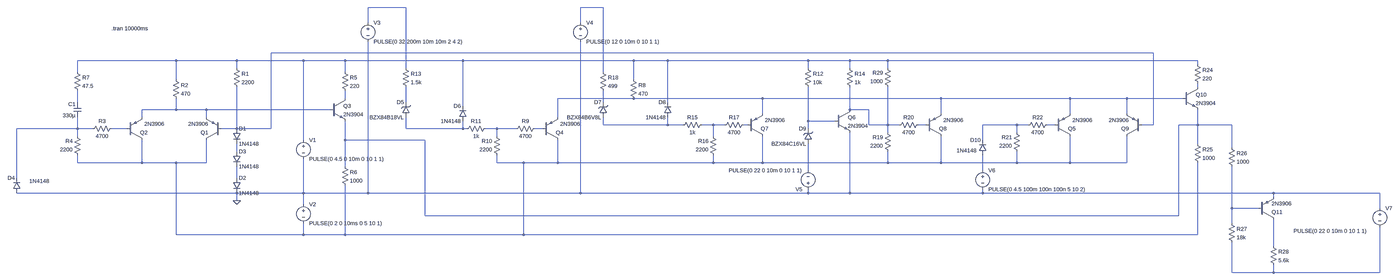
[diagram p0: schematic Powerup_and_voltage_monitor.asc, whole sheet]
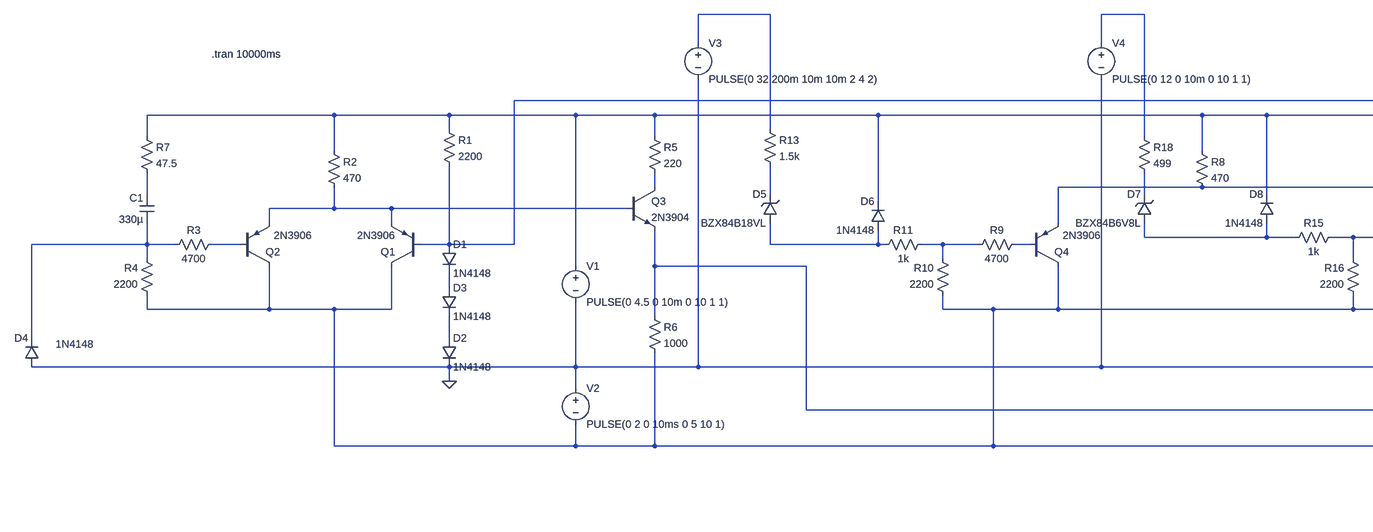
[diagram p1: schematic Powerup_and_voltage_monitor.asc, part, row 1 of 1, column 1 of 2]
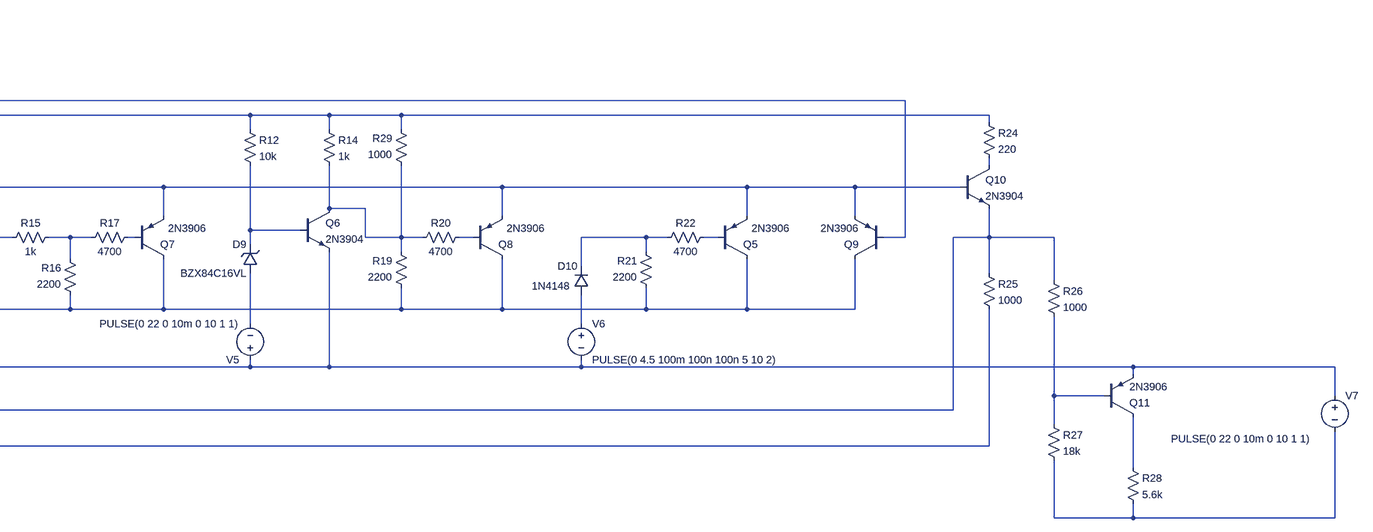
[diagram p2: schematic Powerup_and_voltage_monitor.asc, part, row 1 of 1, column 2 of 2]
Powerup_and_voltage_monitor.asc, the LTspice schematic file:
Version 4
SHEET 1 5904 952
WIRE 1392 -176 1232 -176
WIRE 2224 -176 2128 -176
WIRE 1232 -112 1232 -176
WIRE 2128 -112 2128 -176
WIRE 4544 16 768 16
WIRE 368 48 -48 48
WIRE 624 48 368 48
WIRE 960 48 624 48
WIRE 1136 48 960 48
WIRE 1632 48 1136 48
WIRE 2352 48 1632 48
WIRE 2496 48 2352 48
WIRE 3088 48 2496 48
WIRE 3264 48 3088 48
WIRE 3424 48 3264 48
WIRE 4784 48 3424 48
WIRE 4784 64 4784 48
WIRE 624 80 624 48
WIRE 1392 80 1392 -176
WIRE 3088 80 3088 48
WIRE 3264 80 3264 48
WIRE 3424 80 3424 48
WIRE -48 96 -48 48
WIRE 1136 96 1136 48
WIRE 2224 96 2224 -176
WIRE 368 128 368 48
WIRE 2352 128 2352 48
WIRE 4784 160 4784 144
WIRE 1136 208 1136 176
WIRE 2352 208 2032 208
WIRE 2896 208 2352 208
WIRE 3648 208 2896 208
WIRE 4192 208 3648 208
WIRE 4432 208 4192 208
WIRE 4720 208 4432 208
WIRE -48 224 -48 176
WIRE 1392 224 1392 160
WIRE 2224 224 2224 176
WIRE 2496 224 2496 48
WIRE 1632 240 1632 48
WIRE 368 256 368 208
WIRE 368 256 224 256
WIRE 496 256 368 256
WIRE 1072 256 496 256
WIRE 3264 256 3264 160
WIRE 3344 256 3264 256
WIRE 2896 272 2896 208
WIRE 3648 272 3648 208
WIRE 4192 272 4192 208
WIRE 4432 272 4432 208
WIRE 224 288 224 256
WIRE 496 288 496 256
WIRE 2032 288 2032 208
WIRE 3088 304 3088 160
WIRE 3200 304 3088 304
WIRE 2224 320 2224 288
WIRE 2496 320 2496 288
WIRE 2496 320 2224 320
WIRE 2560 320 2496 320
WIRE 2688 320 2640 320
WIRE 2736 320 2688 320
WIRE 2832 320 2816 320
WIRE 3344 320 3344 256
WIRE 3424 320 3424 160
WIRE 3424 320 3344 320
WIRE 3472 320 3424 320
WIRE 3584 320 3552 320
WIRE 3968 320 3824 320
WIRE 4016 320 3968 320
WIRE 4128 320 4096 320
WIRE 4544 320 4544 16
WIRE 4544 320 4496 320
WIRE 4784 320 4784 256
WIRE 4784 320 4704 320
WIRE 4928 320 4784 320
WIRE -48 336 -48 288
WIRE -48 336 -304 336
WIRE 16 336 -48 336
WIRE 160 336 96 336
WIRE 624 336 624 160
WIRE 624 336 560 336
WIRE 768 336 768 16
WIRE 768 336 624 336
WIRE 1392 336 1392 288
WIRE 1632 336 1632 304
WIRE 1632 336 1392 336
WIRE 1648 336 1632 336
WIRE 1776 336 1728 336
WIRE 1856 336 1776 336
WIRE 1968 336 1936 336
WIRE 3088 336 3088 304
WIRE 3424 352 3424 320
WIRE 3968 352 3968 320
WIRE -48 368 -48 336
WIRE 1776 368 1776 336
WIRE 2688 368 2688 320
WIRE 960 384 960 48
WIRE 1136 384 1136 304
WIRE 1472 384 1136 384
WIRE 3824 384 3824 320
WIRE 4784 400 4784 320
WIRE 4928 416 4928 320
WIRE 624 432 624 400
WIRE -48 480 -48 448
WIRE 224 480 224 384
WIRE 224 480 -48 480
WIRE 368 480 224 480
WIRE 496 480 496 384
WIRE 496 480 368 480
WIRE 1776 480 1776 448
WIRE 1888 480 1776 480
WIRE 2032 480 2032 384
WIRE 2032 480 1888 480
WIRE 2688 480 2688 448
WIRE 2688 480 2032 480
WIRE 2896 480 2896 368
WIRE 2896 480 2688 480
WIRE 3424 480 3424 432
WIRE 3424 480 2896 480
WIRE 3648 480 3648 368
WIRE 3648 480 3424 480
WIRE 3968 480 3968 432
WIRE 3968 480 3648 480
WIRE 4192 480 4192 368
WIRE 4192 480 3968 480
WIRE 4432 480 4432 368
WIRE 4432 480 4192 480
WIRE 1136 496 1136 384
WIRE 3088 512 3088 400
WIRE 3824 512 3824 448
WIRE -304 544 -304 336
WIRE 624 544 624 496
WIRE 624 608 -304 608
WIRE 960 608 960 464
WIRE 960 608 624 608
WIRE 1232 608 1232 -32
WIRE 1232 608 960 608
WIRE 2128 608 2128 -32
WIRE 2128 608 1232 608
WIRE 3088 608 3088 592
WIRE 3088 608 2128 608
WIRE 3264 608 3264 352
WIRE 3264 608 3088 608
WIRE 3824 608 3824 592
WIRE 3824 608 3264 608
WIRE 5104 608 3824 608
WIRE 5552 608 5104 608
WIRE 5104 624 5104 608
WIRE 624 640 624 608
WIRE 960 656 960 608
WIRE 4928 672 4928 496
WIRE 5040 672 4928 672
WIRE 5552 672 5552 608
WIRE 1472 704 1472 384
WIRE 4704 704 4704 320
WIRE 4704 704 1472 704
WIRE 4928 736 4928 672
WIRE 368 784 368 480
WIRE 960 784 960 736
WIRE 960 784 368 784
WIRE 1136 784 1136 576
WIRE 1136 784 960 784
WIRE 1888 784 1888 480
WIRE 1888 784 1136 784
WIRE 4784 784 4784 480
WIRE 4784 784 1888 784
WIRE 5104 832 5104 720
WIRE 4928 944 4928 816
WIRE 5104 944 5104 912
WIRE 5104 944 4928 944
WIRE 5552 944 5552 752
WIRE 5552 944 5104 944
FLAG 624 640 0
SYMBOL pnp 560 384 R180
SYMATTR InstName Q1
SYMATTR Value 2N3906
SYMBOL pnp 160 384 M180
WINDOW 3 74 68 Left 2
SYMATTR Value 2N3906
SYMATTR InstName Q2
SYMBOL Res 608 64 R0
SYMATTR InstName R1
SYMATTR Value 2200
SYMBOL diode 608 336 R0
SYMATTR InstName D1
SYMATTR Value 1N4148
SYMBOL diode 608 544 R0
SYMATTR InstName D2
SYMATTR Value 1N4148
SYMBOL voltage 960 368 R0
WINDOW 123 0 0 Left 0
WINDOW 39 0 0 Left 0
SYMATTR InstName V1
SYMATTR Value PULSE(0 4.5 0 10m 0 10 1 1)
SYMBOL Res 352 112 R0
SYMATTR InstName R2
SYMATTR Value 470
SYMBOL Res 112 320 R90
WINDOW 0 0 56 VBottom 2
WINDOW 3 32 56 VTop 2
SYMATTR InstName R3
SYMATTR Value 4700
SYMBOL Res -32 464 R180
WINDOW 0 36 76 Left 2
WINDOW 3 36 40 Left 2
SYMATTR InstName R4
SYMATTR Value 2200
SYMBOL voltage 960 640 R0
WINDOW 123 0 0 Left 0
WINDOW 39 0 0 Left 0
SYMATTR InstName V2
SYMATTR Value PULSE(0 2 0 10ms 0 5 10 1)
SYMBOL npn 1072 208 R0
SYMATTR InstName Q3
SYMATTR Value 2N3904
SYMBOL Res 1120 80 R0
SYMATTR InstName R5
SYMATTR Value 220
SYMBOL Res 1120 480 R0
SYMATTR InstName R6
SYMATTR Value 1000
SYMBOL diode 608 432 R0
SYMATTR InstName D3
SYMATTR Value 1N4148
SYMBOL cap -32 288 R180
WINDOW 0 24 56 Left 2
WINDOW 3 24 8 Left 2
SYMATTR InstName C1
SYMATTR Value 330µ
SYMBOL res -64 80 R0
SYMATTR InstName R7
SYMATTR Value 47.5
SYMBOL diode -288 608 R180
WINDOW 0 24 64 Left 2
WINDOW 3 -122 51 Left 2
SYMATTR InstName D4
SYMATTR Value 1N4148
SYMBOL pnp 1968 384 M180
WINDOW 3 74 68 Left 2
SYMATTR Value 2N3906
SYMATTR InstName Q4
SYMBOL Res 2336 112 R0
SYMATTR InstName R8
SYMATTR Value 470
SYMBOL Res 1952 320 R90
WINDOW 0 0 56 VBottom 2
WINDOW 3 32 56 VTop 2
SYMATTR InstName R9
SYMATTR Value 4700
SYMBOL Res 1792 464 R180
WINDOW 0 36 76 Left 2
WINDOW 3 36 40 Left 2
SYMATTR InstName R10
SYMATTR Value 2200
SYMBOL zener 1408 288 R180
WINDOW 0 24 64 Left 2
WINDOW 3 24 0 Left 2
SYMATTR InstName D5
SYMATTR Value BZX84B18VL
SYMBOL diode 1648 304 R180
WINDOW 0 24 64 Left 2
WINDOW 3 24 0 Left 2
SYMATTR InstName D6
SYMATTR Value 1N4148
SYMBOL Res 1744 320 R90
WINDOW 0 0 56 VBottom 2
WINDOW 3 32 56 VTop 2
SYMATTR InstName R11
SYMATTR Value 1k
SYMBOL Res 1376 64 R0
SYMATTR InstName R13
SYMATTR Value 1.5k
SYMBOL voltage 1232 -128 R0
WINDOW 123 0 0 Left 0
WINDOW 39 0 0 Left 0
SYMATTR InstName V3
SYMATTR Value PULSE(0 32 200m 10m 10m 2 4 2)
SYMBOL zener 2240 288 R180
WINDOW 0 24 64 Left 2
WINDOW 3 24 0 Left 2
SYMATTR InstName D7
SYMATTR Value BZX84B6V8L
SYMBOL diode 2512 288 R180
WINDOW 0 24 64 Left 2
WINDOW 3 24 0 Left 2
SYMATTR InstName D8
SYMATTR Value 1N4148
SYMBOL Res 2656 304 R90
WINDOW 0 0 56 VBottom 2
WINDOW 3 32 56 VTop 2
SYMATTR InstName R15
SYMATTR Value 1k
SYMBOL Res 2704 464 R180
WINDOW 0 36 76 Left 2
WINDOW 3 36 40 Left 2
SYMATTR InstName R16
SYMATTR Value 2200
SYMBOL Res 2832 304 R90
WINDOW 0 0 56 VBottom 2
WINDOW 3 32 56 VTop 2
SYMATTR InstName R17
SYMATTR Value 4700
SYMBOL voltage 2128 -128 R0
WINDOW 123 0 0 Left 0
WINDOW 39 0 0 Left 0
SYMATTR InstName V4
SYMATTR Value PULSE(0 12 0 10m 0 10 1 1)
SYMBOL Res 2208 80 R0
SYMATTR InstName R18
SYMATTR Value 499
SYMBOL npn 3200 256 R0
SYMATTR InstName Q6
SYMATTR Value 2N3904
SYMBOL voltage 3088 608 R180
WINDOW 123 0 0 Left 0
WINDOW 39 0 0 Left 0
SYMATTR InstName V5
SYMATTR Value PULSE(0 22 0 10m 0 10 1 1)
SYMBOL zener 3104 400 R180
WINDOW 0 24 64 Left 2
WINDOW 3 24 0 Left 2
SYMATTR InstName D9
SYMATTR Value BZX84C16VL
SYMBOL Res 3072 64 R0
SYMATTR InstName R12
SYMATTR Value 10k
SYMBOL Res 3248 64 R0
SYMATTR InstName R14
SYMATTR Value 1k
SYMBOL Res 3440 448 R180
WINDOW 0 36 76 Left 2
WINDOW 3 36 40 Left 2
SYMATTR InstName R19
SYMATTR Value 2200
SYMBOL Res 3568 304 R90
WINDOW 0 0 56 VBottom 2
WINDOW 3 32 56 VTop 2
SYMATTR InstName R20
SYMATTR Value 4700
SYMBOL pnp 2832 368 M180
WINDOW 3 74 68 Left 2
SYMATTR Value 2N3906
SYMATTR InstName Q7
SYMBOL pnp 3584 368 M180
WINDOW 3 74 68 Left 2
SYMATTR Value 2N3906
SYMATTR InstName Q8
SYMBOL voltage 3824 496 R0
WINDOW 123 0 0 Left 0
WINDOW 39 0 0 Left 0
SYMATTR InstName V6
SYMATTR Value PULSE(0 4.5 100m 100n 100n 5 10 2)
SYMBOL diode 3840 448 R180
WINDOW 0 24 64 Left 2
WINDOW 3 41 20 Left 2
SYMATTR InstName D10
SYMATTR Value 1N4148
SYMBOL Res 3984 448 R180
WINDOW 0 36 76 Left 2
WINDOW 3 36 40 Left 2
SYMATTR InstName R21
SYMATTR Value 2200
SYMBOL Res 4112 304 R90
WINDOW 0 0 56 VBottom 2
WINDOW 3 32 56 VTop 2
SYMATTR InstName R22
SYMATTR Value 4700
SYMBOL pnp 4128 368 M180
WINDOW 3 74 68 Left 2
SYMATTR Value 2N3906
SYMATTR InstName Q5
SYMBOL pnp 4496 368 R180
SYMATTR InstName Q9
SYMATTR Value 2N3906
SYMBOL npn 4720 160 R0
SYMATTR InstName Q10
SYMATTR Value 2N3904
SYMBOL res 4768 48 R0
SYMATTR InstName R24
SYMATTR Value 220
SYMBOL Res 4768 384 R0
SYMATTR InstName R25
SYMATTR Value 1000
SYMBOL pnp 5040 720 M180
SYMATTR InstName Q11
SYMATTR Value 2N3906
SYMBOL Res 4912 400 R0
SYMATTR InstName R26
SYMATTR Value 1000
SYMBOL Res 4912 720 R0
SYMATTR InstName R27
SYMATTR Value 18k
SYMBOL voltage 5552 656 R0
WINDOW 3 -364 112 Left 2
WINDOW 123 0 0 Left 0
WINDOW 39 0 0 Left 0
SYMATTR InstName V7
SYMATTR Value PULSE(0 22 0 10m 0 10 1 1)
SYMBOL Res 5088 816 R0
SYMATTR InstName R28
SYMATTR Value 5.6k
SYMBOL Res 3440 176 R180
WINDOW 0 36 76 Left 2
WINDOW 3 36 40 Left 2
SYMATTR InstName R29
SYMATTR Value 1000
TEXT 96 -88 Left 2 !.tran 10000ms

The netlist it stands for:
* Powerup_and_voltage_monitor.asc
Q1 N027 N003 N011 0 2N3906
Q2 N027 N022 N011 0 2N3906
R1 N004 N003 2200
D1 N003 N026 1N4148
D2 N030 0 1N4148
V1 N004 0 PULSE(0 4.5 0 10m 0 10 1 1)
R2 N004 N011 470
R3 N022 N021 4700
R4 N027 N021 2200
V2 0 N027 PULSE(0 2 0 10ms 0 5 10 1)
Q3 N006 N011 N020 0 2N3904
R5 N004 N006 220
R6 N020 N027 1000
D3 N026 N030 1N4148
C1 N021 N008 330µ
R7 N004 N008 47.5
D4 0 N021 1N4148
Q4 N027 N025 N007 0 2N3906
R8 N004 N007 470
R9 N025 N024 4700
R10 N027 N024 2200
D5 N023 N009 BZX84B18VL
D6 N023 N004 1N4148
R11 N024 N023 1k
R13 N001 N009 1.5k
V3 N001 0 PULSE(0 32 200m 10m 10m 2 4 2)
D7 N014 N010 BZX84B6V8L
D8 N014 N004 1N4148
R15 N015 N014 1k
R16 N027 N015 2200
R17 N016 N015 4700
V4 N002 0 PULSE(0 12 0 10m 0 10 1 1)
R18 N002 N010 499
Q6 N012 N013 0 0 2N3904
V5 0 N028 PULSE(0 22 0 10m 0 10 1 1)
D9 N028 N013 BZX84C16VL
R12 N004 N013 10k
R14 N004 N012 1k
R19 N027 N012 2200
R20 N017 N012 4700
Q7 N027 N016 N007 0 2N3906
Q8 N027 N017 N007 0 2N3906
V6 N029 0 PULSE(0 4.5 100m 100n 100n 5 10 2)
D10 N029 N018 1N4148
R21 N027 N018 2200
R22 N019 N018 4700
Q5 N027 N019 N007 0 2N3906
Q9 N027 N003 N007 0 2N3906
Q10 N005 N007 N020 0 2N3904
R24 N004 N005 220
R25 N020 N027 1000
Q11 N032 N031 0 0 2N3906
R26 N020 N031 1000
R27 N031 N033 18k
V7 0 N033 PULSE(0 22 0 10m 0 10 1 1)
R28 N032 N033 5.6k
R29 N012 N004 1000
.model D D
.lib standard.dio
.model NPN NPN
.model PNP PNP
.lib standard.bjt
.tran 10000ms
.backanno
.end